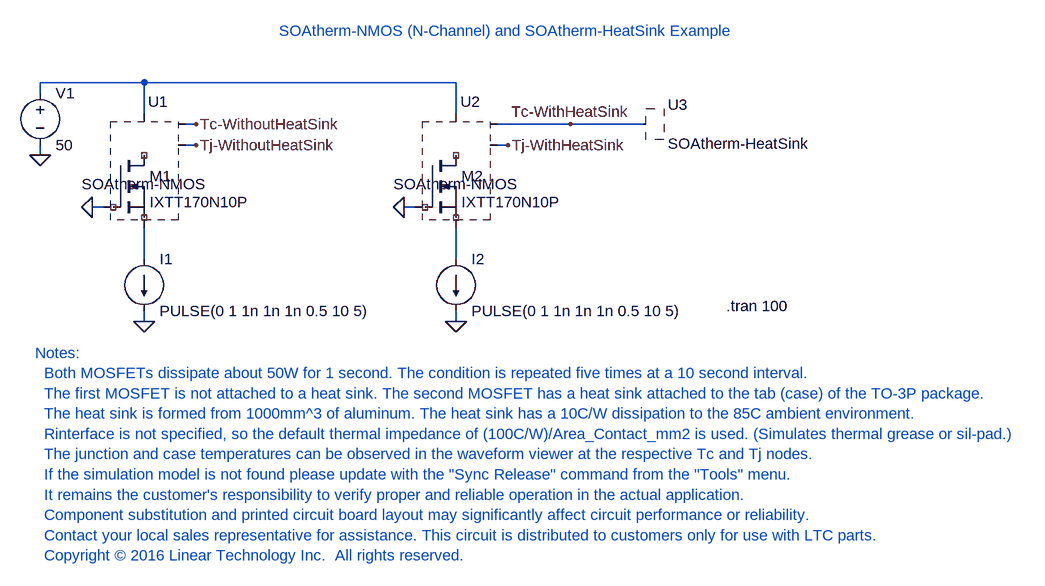
[diagram p0: schematic SOAtherm-HeatSink-Example.asc]
SOAtherm-HeatSink-Example.asc, the LTspice schematic file:
Version 4
SHEET 1 1856 956
WIRE -288 -16 -448 -16
WIRE 192 -16 -288 -16
WIRE -448 0 -448 -16
WIRE -288 32 -288 -16
WIRE 192 32 192 -16
WIRE -208 48 -224 48
WIRE 368 48 256 48
WIRE 480 48 368 48
WIRE -208 80 -224 80
WIRE 272 80 256 80
WIRE -448 96 -448 80
WIRE -352 176 -368 176
WIRE 128 176 112 176
WIRE -288 256 -288 208
WIRE 192 256 192 208
WIRE -288 352 -288 336
WIRE 192 352 192 336
FLAG -288 352 0
FLAG 192 352 0
FLAG -368 176 0
FLAG 112 176 0
FLAG -208 80 Tj-WithoutHeatSink
FLAG -208 48 Tc-WithoutHeatSink
FLAG 272 80 Tj-WithHeatSink
FLAG 368 48 Tc-WithHeatSink
FLAG -448 96 0
SYMBOL nmos 144 96 R0
SYMATTR InstName M2
SYMATTR Value IXTT170N10P
SYMBOL SOAtherm-NMOS 192 144 R0
WINDOW 0 7 -131 Left 2
SYMATTR InstName U2
SYMATTR SpiceModel IXTQ170N10P
SYMBOL nmos -336 96 R0
SYMATTR InstName M1
SYMATTR Value IXTT170N10P
SYMBOL SOAtherm-NMOS -288 144 R0
WINDOW 0 6 -131 Left 2
SYMATTR InstName U1
SYMATTR SpiceModel IXTQ170N10P
SYMBOL voltage -448 -16 R0
WINDOW 123 24 138 Left 2
WINDOW 39 24 117 Left 2
SYMATTR InstName V1
SYMATTR Value 50
SYMBOL current -288 256 R0
WINDOW 123 0 0 Left 2
WINDOW 39 0 0 Left 2
SYMATTR InstName I1
SYMATTR Value PULSE(0 1 1n 1n 1n 0.5 10 5)
SYMBOL current 192 256 R0
SYMATTR InstName I2
SYMATTR Value PULSE(0 1 1n 1n 1n 0.5 10 5)
SYMBOL SOAtherm-HeatSink 560 48 R0
SYMATTR InstName U3
SYMATTR Value2 Area_Contact_mm2=200 Volume_mm3=2000
SYMATTR SpiceModel aluminum
TEXT 608 328 Left 2 !.tran 100
TEXT -456 400 Left 2 ;Notes: \n  Both MOSFETs dissipate about 50W for 1 second. The condition is repeated five times at a 10 second interval.\n  The first MOSFET is not attached to a heat sink. The second MOSFET has a heat sink attached to the tab (case) of the TO-3P package.\n  The heat sink is formed from 1000mm^3 of aluminum. The heat sink has a 10C/W dissipation to the 85C ambient environment.\n  Rinterface is not specified, so the default thermal impedance of (100C/W)/Area_Contact_mm2 is used. (Simulates thermal grease or sil-pad.)\n  The junction and case temperatures can be observed in the waveform viewer at the respective Tc and Tj nodes.\n  If the simulation model is not found please update with the "Sync Release" command from the "Tools" menu.\n  It remains the customer's responsibility to verify proper and reliable operation in the actual application.\n  Component substitution and printed circuit board layout may significantly affect circuit performance or reliability.\n  Contact your local sales representative for assistance. This circuit is distributed to customers only for use with LTC parts.\n  Copyright © 2016 Linear Technology Inc.  All rights reserved.
TEXT 272 -80 Bottom 2 ;SOAtherm-NMOS (N-Channel) and SOAtherm-HeatSink Example

The netlist it stands for:
* SOAtherm-HeatSink-Example.asc
M2 NC_01 NC_02 NC_03 NC_03 IXTT170N10P
* U2: IXTQ170N10P (symbol SOAtherm-NMOS not available, pin order unknown); nets seen at it: 0, N001, N003, Tc-WithHeatSink, Tj-WithHeatSink
M1 NC_04 NC_05 NC_06 NC_06 IXTT170N10P
* U1: IXTQ170N10P (symbol SOAtherm-NMOS not available, pin order unknown); nets seen at it: 0, N001, N002, Tc-WithoutHeatSink, Tj-WithoutHeatSink
V1 N001 0 50
I1 N002 0 PULSE(0 1 1n 1n 1n 0.5 10 5)
I2 N003 0 PULSE(0 1 1n 1n 1n 0.5 10 5)
* U3: aluminum Area_Contact_mm2=200 Volume_mm3=2000 (symbol SOAtherm-HeatSink not available, pin order unknown); nets seen at it: Tc-WithHeatSink
.model NMOS NMOS
.model PMOS PMOS
.lib standard.mos
.tran 100
* Notes:
*   Both MOSFETs dissipate about 50W for 1 second. The condition is repeated five times at a 10 second interval.
*   The first MOSFET is not attached to a heat sink. The second MOSFET has a heat sink attached to the tab (case) of the TO-3P package.
*   The heat sink is formed from 1000mm^3 of aluminum. The heat sink has a 10C/W dissipation to the 85C ambient environment.
*   Rinterface is not specified, so the default thermal impedance of (100C/W)/Area_Contact_mm2 is used. (Simulates thermal grease or sil-pad.)
*   The junction and case temperatures can be observed in the waveform viewer at the respective Tc and Tj nodes.
*   If the simulation model is not found please update with the "Sync Release" command from the "Tools" menu.
*   It remains the customer's responsibility to verify proper and reliable operation in the actual application.
*   Component substitution and printed circuit board layout may significantly affect circuit performance or reliability.
*   Contact your local sales representative for assistance. This circuit is distributed to customers only for use with LTC parts.
*   Copyright © 2016 Linear Technology Inc.  All rights reserved.
* SOAtherm-NMOS (N-Channel) and SOAtherm-HeatSink Example
.backanno
.end